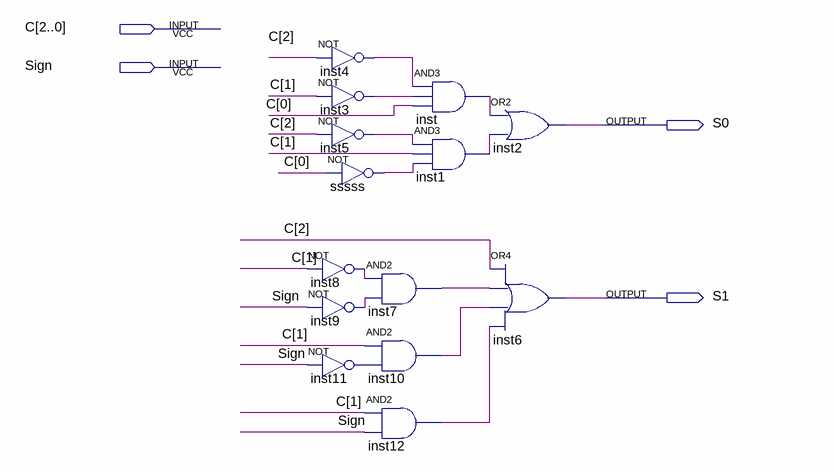
[diagram p0: schematic sheet]
// Quartus schematic Control_AU2state.bdf as structural Verilog: 14 symbols, 4 pins
module Control_AU2state (
  input  [2:0] C,
  input  Sign,
  output S0,
  output S1
);

  wire inst1_out, inst3_out, inst4_out, inst5_out, inst7_out, inst8_out, inst9_out, inst10_out, inst11_out,
       inst12_out, inst_out, sssss_out;

  not inst4 (inst4_out, C[2]);
  not inst3 (inst3_out, C[1]);
  not inst5 (inst5_out, C[2]);
  not inst8 (inst8_out, C[1]);
  not inst9 (inst9_out, Sign);
  not inst11 (inst11_out, Sign);
  not sssss (sssss_out, C[0]);
  and inst7 (inst7_out, inst8_out, inst9_out);
  and inst10 (inst10_out, C[1], inst11_out);
  and inst12 (inst12_out, C[1], Sign);
  and inst (inst_out, inst4_out, inst3_out, C[0]);
  and inst1 (inst1_out, inst5_out, C[1], sssss_out);
  or inst2 (S0, inst_out, inst1_out);
  or inst6 (S1, C[2], inst7_out, inst10_out, inst12_out);
endmodule
